# EAGLE design usb64 (EAGLE 9.6.2)
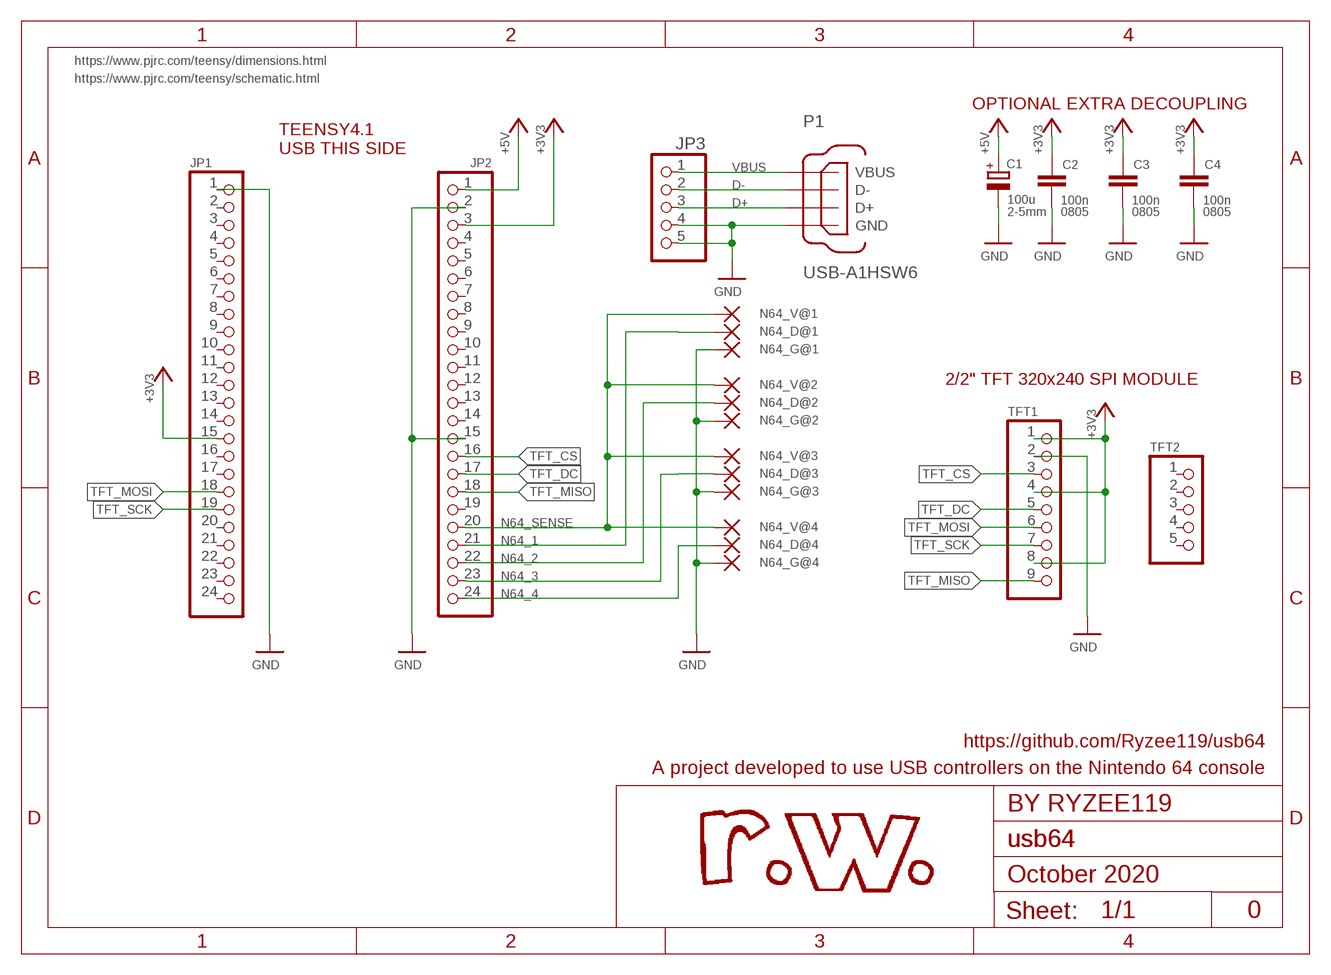
[diagram p0: schematic, sheet 1]

## Parts
C1  100u  CPOL-EUE2-5  [E2-5]
C2  100n  C-EUC0805K  [C0805K]
C3  100n  C-EUC0805K  [C0805K]
C4  100n  C-EUC0805K  [C0805K]
JP1  PINHD-1X24  [1X24]
JP2  PINHD-1X24  [1X24]
JP3  PINHD-1X5  [1X05]
N64_D@1  SMD2  [SMD1,27-2,54]
N64_D@2  SMD2  [SMD1,27-2,54]
N64_D@3  SMD2  [SMD1,27-2,54]
N64_D@4  SMD2  [SMD1,27-2,54]
N64_G@1  SMD2  [SMD1,27-2,54]
N64_G@2  SMD2  [SMD1,27-2,54]
N64_G@3  SMD2  [SMD1,27-2,54]
N64_G@4  SMD2  [SMD1,27-2,54]
N64_V@1  SMD2  [SMD1,27-2,54]
N64_V@2  SMD2  [SMD1,27-2,54]
N64_V@3  SMD2  [SMD1,27-2,54]
N64_V@4  SMD2  [SMD1,27-2,54]
P1  USB-A1HSW6  [OST_USB-A1HSW6]
TFT1  PINHD-1X9  [1X09]
TFT2  PINHD-1X5  [1X05]

## Nets
+3V3: C2.1 C3.1 C4.1 JP1.15 JP2.3 TFT1.1 TFT1.4 TFT1.8
+5V: C1.+ JP2.1
D+: JP3.3 P1.3(D+)
D-: JP3.2 P1.2(D-)
GND: C1.- C2.2 C3.2 C4.2 JP1.1 JP2.2 JP2.15 JP3.4 JP3.5 N64_G@1.1(P) N64_G@2.1(P) N64_G@3.1(P) N64_G@4.1(P) P1.4(GND) TFT1.2
N64_1: JP2.21 N64_D@1.1(P)
N64_2: JP2.22 N64_D@2.1(P)
N64_3: JP2.23 N64_D@3.1(P)
N64_4: JP2.24 N64_D@4.1(P)
N64_SENSE: JP2.20 N64_V@1.1(P) N64_V@2.1(P) N64_V@3.1(P) N64_V@4.1(P)
TFT_CS: JP2.16 TFT1.3
TFT_DC: JP2.17 TFT1.5
TFT_MISO: JP2.18 TFT1.9
TFT_MOSI: JP1.18 TFT1.6
TFT_SCK: JP1.19 TFT1.7
VBUS: JP3.1 P1.1(VBUS)
Unconnected: JP1.2 JP1.3 JP1.4 JP1.5 JP1.6 JP1.7 JP1.8 JP1.9 JP1.10 JP1.11 JP1.12 JP1.13 JP1.14 JP1.16 JP1.17 JP1.20 JP1.21 JP1.22 JP1.23 JP1.24 JP2.4 JP2.5 JP2.6 JP2.7 JP2.8 JP2.9 JP2.10 JP2.11 JP2.12 JP2.13 JP2.14 JP2.19 TFT2.1 TFT2.2 TFT2.3 TFT2.4 TFT2.5

## Notes on the sheet
- https://www.pjrc.com/teensy/dimensions.html
- https://www.pjrc.com/teensy/schematic.html
- OPTIONAL EXTRA DECOUPLING
- TEENSY4.1
  USB THIS SIDE
- 2-5mm | 0805 | 0805 | 0805
- 2/2" TFT 320x240 SPI MODULE
- https://github.com/Ryzee119/usb64
- A project developed to use USB controllers on the Nintendo 64 console
- BY RYZEE119
- usb64
- October 2020
- 0

## Library data of the parts
C1 = rcl:CPOL-EU: POLARIZED CAPACITOR, European symbol; SPICEPREFIX: C
C2-C4 = rcl:C-EU: CAPACITOR, European symbol; SPICEPREFIX: C
JP1 JP2 = pinhead:PINHD-1X24: PIN HEADER
JP3 TFT2 = pinhead:PINHD-1X5: PIN HEADER
N64_D@1-N64_D@4 N64_G@1-N64_G@4 N64_V@1-N64_V@4 = my-library:SMD2: SMD PAD
P1 = my-library:USB-A1HSW6: USB - A Receptacle Connector 4 Position Through Hole, Right Angle; DESCRIPTION: USB-A (USB TYPE-A) Receptacle Connector 4 Position Through Hole, Right Angle; DIGI-KEY_PART_NUMBER: ED2989-ND; MF: On Shore; MP: USB-A1HSW6; PACKAGE: None; PURCHASE-URL: https://pricing.snapeda.com/search/part/USB-A1HSW6/?ref=eda
TFT1 = pinhead:PINHD-1X9: PIN HEADER

## Board
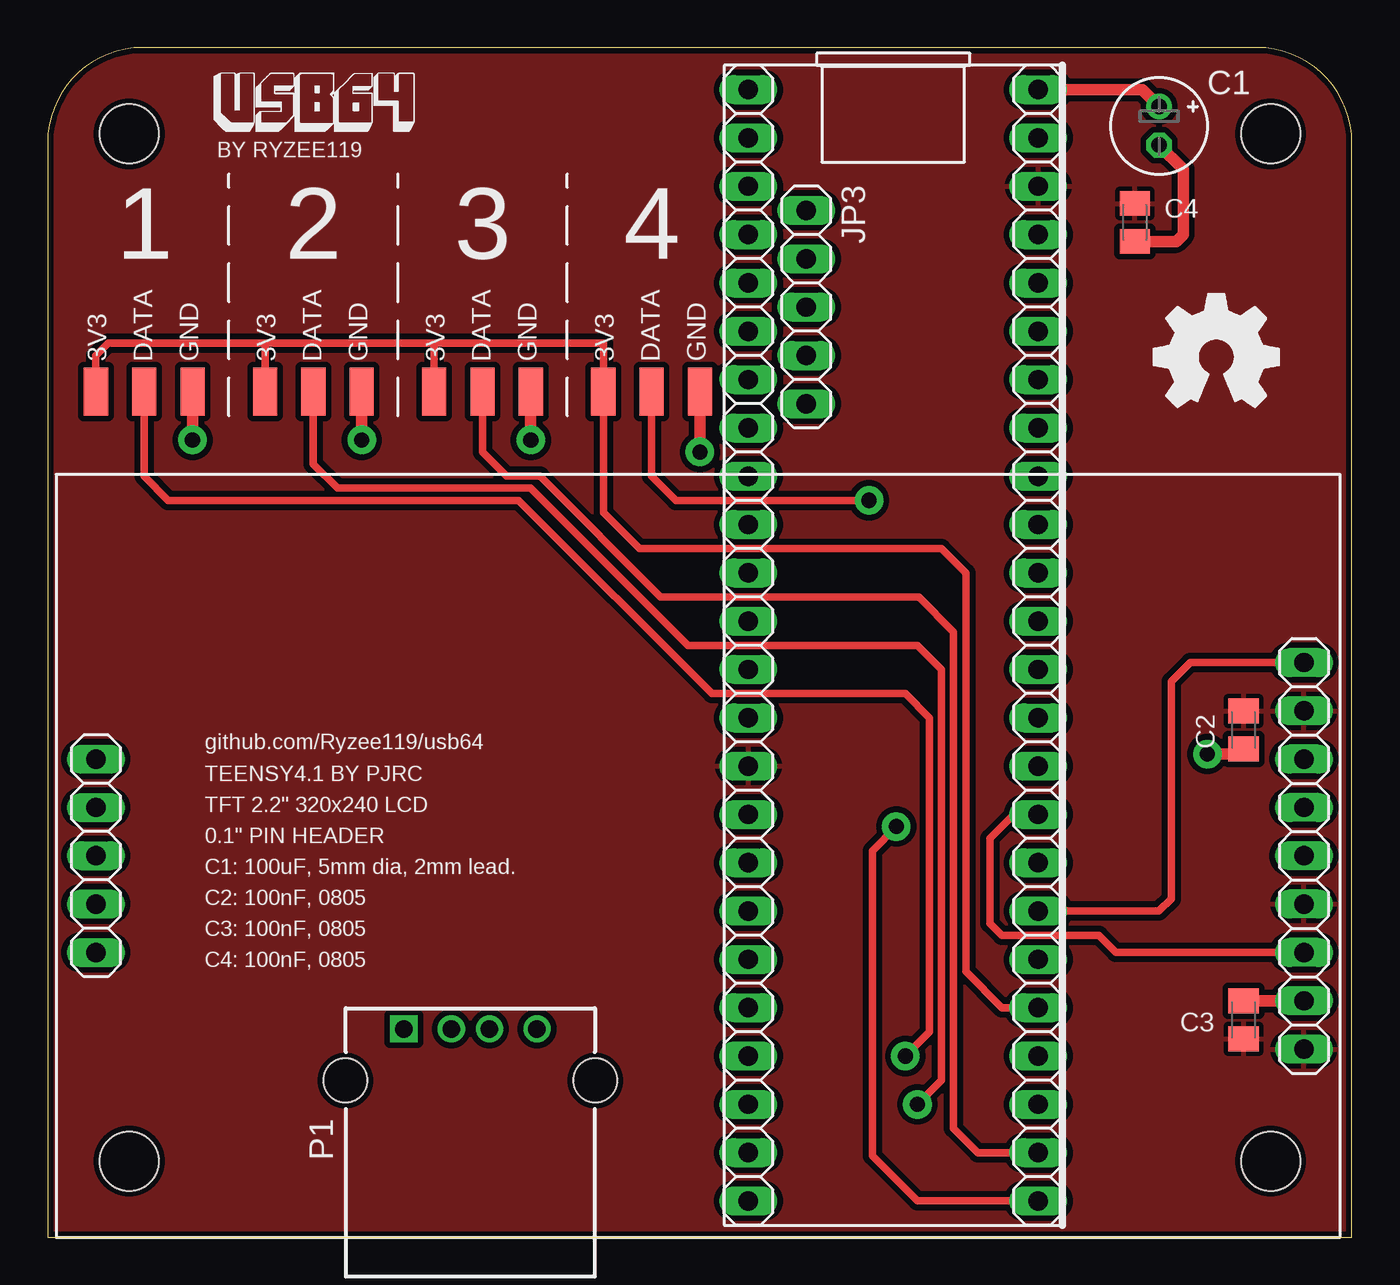
[diagram p1: board, top side]
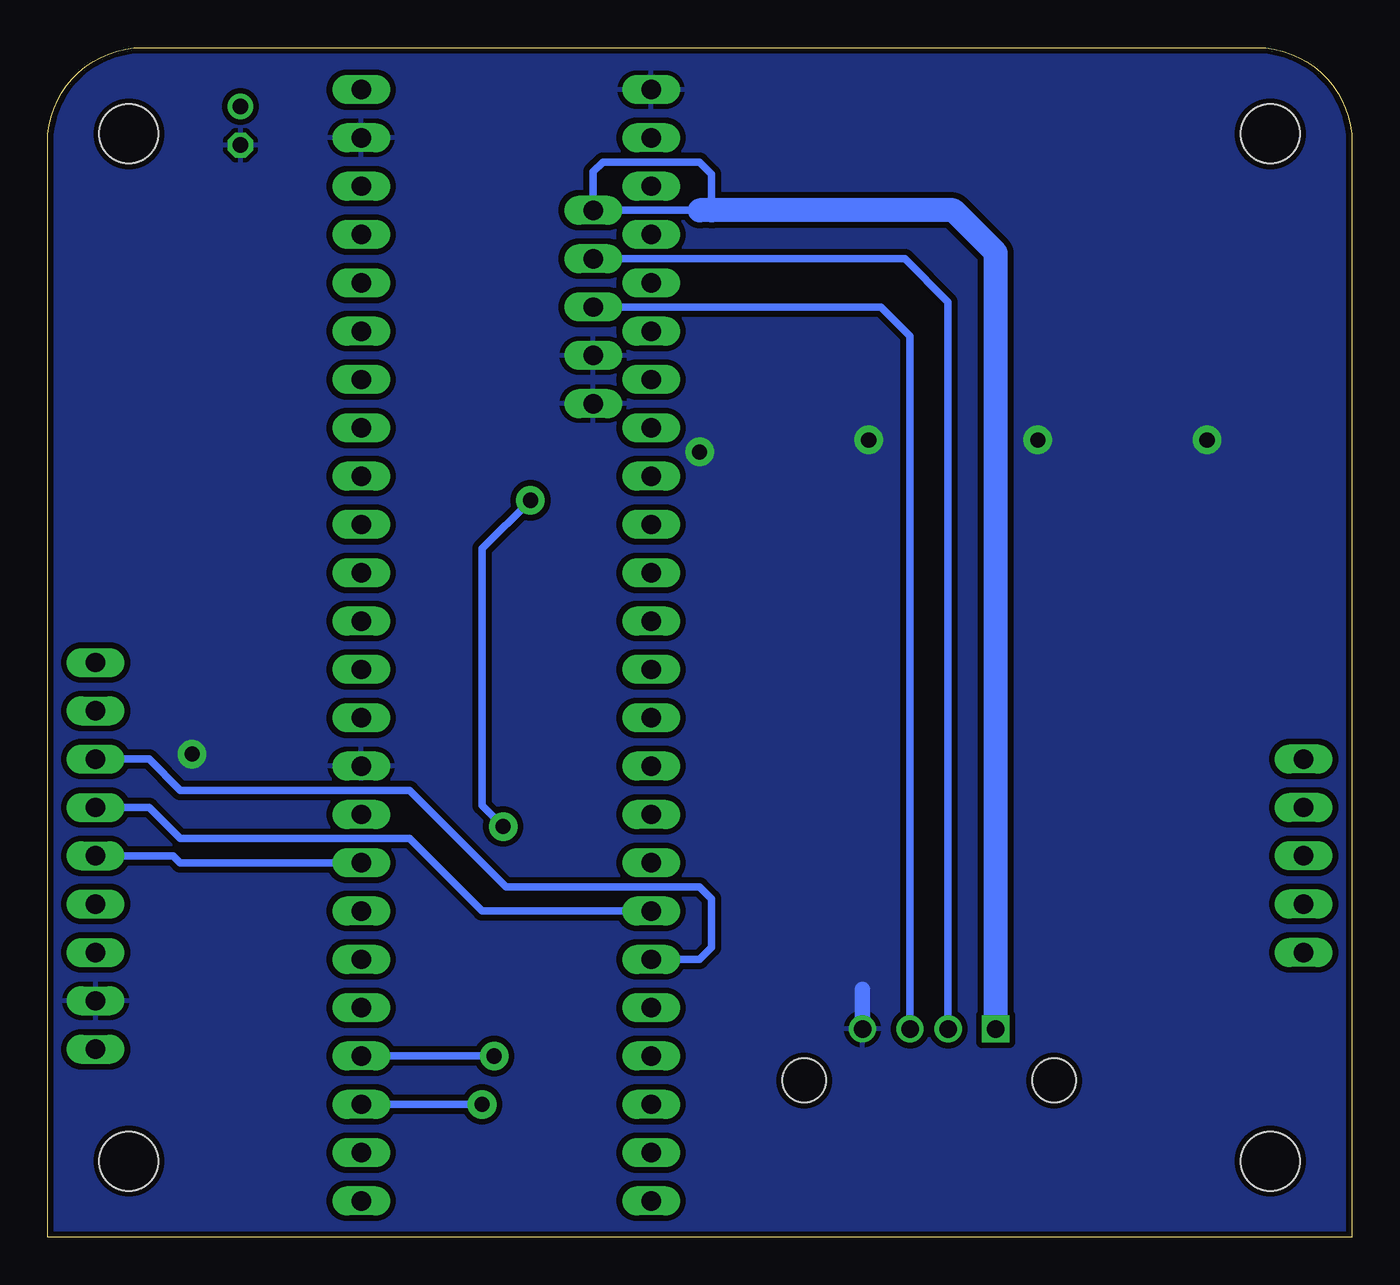
[diagram p2: board, bottom side, seen from below]

Size 68.56 x 62.53 mm. Coordinates in mm from the lower left corner, seen from the top.
Outline: 0,0 68.56,0 68.56,57.53 arc90 63.56,62.53 5,62.53 arc90 0,57.53 0,0
Copper layers (1*16): Top 0.035mm / dielectric 1.5mm / Bottom 0.035mm
Design rules "Elecrow_2-layer_eagle_rule": minimum track width 6mil, minimum drill 12mil, track to track 6mil, track to pad 6mil, pad to pad 6mil, via to via 6mil, smd to smd 0mil, copper to edge 10mil, drill to drill 10mil, minimum pad ring 10mil, minimum via ring 6mil, stop-mask expansion 2mil, vias tented up to drill 100mil, thermal gap 10mil
Holes 3.1 mm at 4.29,4 64.29,4 4.29,58 64.29,58

### Footprints (pad centres in the part's own frame; a part is rotated, then mirrored left to right if it is on the bottom)
E2-5 = drill 0.813 pad 1.27: + -1.016,0 | drill 0.813 pad 1.27 octagon: - 1.016,0
C0805K = smd 1.3 x 1.6: 1 -1,0; 2 1,0
1X24 = drill 1.016 long: 1 -29.21,0; 2 -26.67,0; 3 -24.13,0; 4 -21.59,0; 5 -19.05,0; 6 -16.51,0; 7 -13.97,0; 8 -11.43,0; 9 -8.89,0; 10 -6.35,0; 11 -3.81,0; 12 -1.27,0; 13 1.27,0; 14 3.81,0; 15 6.35,0; 16 8.89,0; 17 11.43,0; 18 13.97,0; 19 16.51,0; 20 19.05,0; 21 21.59,0; 22 24.13,0; 23 26.67,0; 24 29.21,0
1X05 = drill 1.016 long: 1 -5.08,0; 2 -2.54,0; 3 0,0; 4 2.54,0; 5 5.08,0
SMD1,27-2,54 = smd 1.27 x 2.54: 1 0,0
OST_USB-A1HSW6 = drill 0.92 square: 1 -3.5,6.51 | drill 0.92: 2 -1,6.51; 3 1,6.51; 4 3.5,6.51 | hole 2.3: -6.57,3.8; 6.57,3.8
1X09 = drill 1.016 long: 1 -10.16,0; 2 -7.62,0; 3 -5.08,0; 4 -2.54,0; 5 0,0; 6 2.54,0; 7 5.08,0; 8 7.62,0; 9 10.16,0

### Placement (x,y rotation side)
C1  58.42,58.42 270 top
C2  62.87,26.67 270 top
C3  62.87,11.43 90 top
C4  57.15,53.34 270 top
JP1  36.83,31.11 270 top
JP2  52.07,31.11 270 top
JP3  39.88,48.9 270 top
N64_D@1  5.08,44.45 0 top
N64_D@2  13.97,44.45 0 top
N64_D@3  22.86,44.45 0 top
N64_D@4  31.75,44.45 0 top
N64_G@1  7.62,44.45 0 top
N64_G@2  16.51,44.45 0 top
N64_G@3  25.4,44.45 0 top
N64_G@4  34.29,44.45 0 top
N64_V@1  2.54,44.45 0 top
N64_V@2  11.43,44.45 0 top
N64_V@3  20.32,44.45 0 top
N64_V@4  29.21,44.45 0 top
P1  22.23,4.45 0 top
TFT1  66.04,20.05 90 top
TFT2  2.54,20.05 270 top

### Tracks (layer width: path | path; a pad name or v marks a point on that pad's centre or on a via)
+3V3
  pour Top (isolate 0.305): -3.81,69.85 -3.81,-1.27 72.39,-1.27 72.39,69.85
+5V
  Top 0.61: JP2.1 57.53,60.33 C1.+
D+
  Bottom 0.406: P1.3 23.23,47.35 24.77,48.9 JP3.3
D-
  Bottom 0.406: P1.2 21.23,49.16 23.5,51.44 JP3.2
GND  (via drill 0.8 pad 1.5)
  Top 0.61: N64_G@1.1 v7.62,41.91 | N64_G@2.1 v16.51,41.91 | N64_G@3.1 v25.4,41.91 | N64_G@4.1 v34.29,41.27 | C4.2 59.33,52.34 59.69,52.7 59.69,56.13 C1.- | C3.2 TFT1.2 | C2.2 62.59,25.4 v60.96,25.4
  Bottom 0.813: P1.4 25.73,13.03
  pour Bottom (isolate 0.305): -3.81,72.39 -3.81,-3.81 78.74,-3.81 78.74,72.39
N64_1  (via drill 0.8 pad 1.5)
  Top 0.406: N64_D@1.1 5.08,40.01 6.35,38.73 24.77,38.73 34.92,28.57 45.09,28.57 46.35,27.3 46.35,10.79 v45.09,9.53
  Bottom 0.406: v45.09,9.53 JP2.21
N64_2  (via drill 0.8 pad 1.5)
  Top 0.406: N64_D@2.1 13.97,40.64 15.24,39.37 25.4,39.37 33.66,31.11 45.72,31.11 46.99,29.84 46.99,8.26 v45.72,6.99
  Bottom 0.406: v45.72,6.99 JP2.22
N64_3
  Top 0.406: N64_D@3.1 22.86,41.27 24.13,40.01 25.88,40.01 32.23,33.66 45.8,33.66 47.62,31.83 47.62,5.71 48.9,4.45 JP2.23
N64_4  (via drill 0.8 pad 1.5)
  Top 0.406: N64_D@4.1 31.75,40.01 33.02,38.73 v43.18,38.73 | v44.61,21.59 43.34,20.32 43.34,10.62 43.34,4.28 45.72,1.91 JP2.24
  Bottom 0.406: v43.18,38.73 45.72,36.2 45.72,22.7 v44.61,21.59
N64_SENSE
  Top 0.406: JP2.20 50.16,12.06 48.26,13.97 48.26,34.92 46.99,36.2 31.11,36.2 29.21,38.1 N64_V@4.1 29.21,46.99 20.32,46.99 | N64_V@1.1 2.54,46.35 3.17,46.99 11.43,46.99 | 11.43,46.99 20.32,46.99 | N64_V@2.1 11.43,46.99 | N64_V@3.1 20.32,46.99
TFT_CS
  Top 0.406: TFT1.3 56.15,14.97 55.24,15.88 50.16,15.88 49.53,16.51 49.53,20.95 50.8,22.23 JP2.16
TFT_DC
  Bottom 0.406: JP2.17 58.42,19.68 61.59,19.68 61.96,20.05 TFT1.5
TFT_MISO
  Top 0.406: TFT1.9 60.05,30.21 59.05,29.21 59.05,17.78 58.42,17.14 JP2.18
TFT_MOSI
  Bottom 0.406: JP1.18 45.72,17.14 49.53,20.95 61.59,20.95 63.23,22.59 TFT1.6
TFT_SCK
  Bottom 0.406: JP1.19 34.29,14.61 33.66,15.24 33.66,17.78 34.29,18.41 44.45,18.41 49.53,23.5 61.59,23.5 63.23,25.13 TFT1.7
VBUS
  Bottom 0.406: 34.29,53.98 JP3.1 39.88,56.01 39.37,56.52 34.29,56.52 33.66,55.88 33.66,53.98
  Bottom 1.27: 34.29,53.98 33.66,53.98 20.95,53.98 18.73,51.74 P1.1

### Text on the board
tPlace: BY RYZEE119 | 1 | 2 | 3 | 4 | 3V3 / DATA / GND | 3V3 / DATA / GND | 3V3 / DATA / GND | 3V3 / DATA / GND | github.com/Ryzee119/usb64 | TEENSY4.1 BY PJRC / TFT 2.2" 320x240 LCD / 0.1" PIN HEADER / C1: 100uF, 5mm dia, 2mm lead. / C2: 100nF, 0805 / C3: 100nF, 0805 / C4: 100nF, 0805